# Altium schematic sheet HighCurrentSwitches.SchDoc
size A
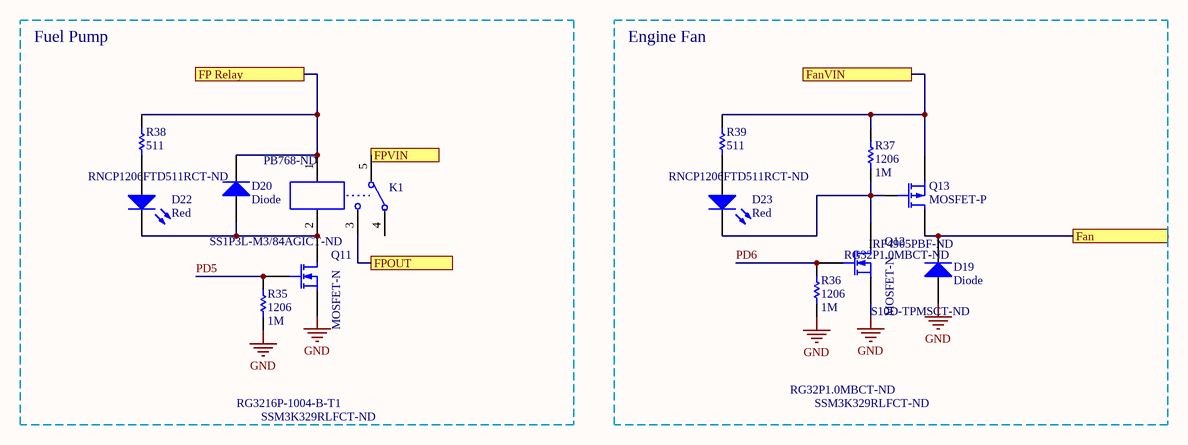
[diagram p0: HighCurrentSwitches.SchDoc]

## Parts
D19  Diode  Supplier Part Number: S10D-TPMSCT-ND  [SMC]
D20  Diode  Supplier Part Number: SS1P3L-M3/84AGICT-ND  [DO-220AA]
D22  Red  [LEDC3216X120NRED]
D23  Red  [LEDC3216X120NRED]
K1  Supplier Part Number: PB768-ND  [TECO-PB134-5_V]  (hidden comment: PB134012)
Q11  MOSFET-N  Supplier Part Number: SSM3K329RLFCT-ND  [SOT23-3]
Q12  MOSFET-N  Supplier Part Number: SSM3K329RLFCT-ND  [SOT23-3]
Q13  MOSFET-P  Supplier Part Number: IRF4905PBF-ND  [TO-220AB]
R35  1206  value 1M  Supplier Part Number: RG3216P-1004-B-T1  [RESC3216X60N]
R36  1206  value 1M  Supplier Part Number: RG32P1.0MBCT-ND  [RESC3216X60N]
R37  1206  value 1M  Supplier Part Number: RG32P1.0MBCT-ND  [RESC3216X60N]
R38  511  Supplier Part Number: RNCP1206FTD511RCT-ND  [RESC3216X60N]
R39  511  Supplier Part Number: RNCP1206FTD511RCT-ND  [RESC3216X60N]

## Blocks framed on the sheet
Fuel Pump: D20 D22 K1 Q11 R35 R38
Engine Fan: D19 D23 Q12 Q13 R36 R37 R39

## Ports
Fan, FanVIN, FP Relay, FPOUT, FPVIN

## Nets
GND: D19.1(A) Q11.3(S) Q12.3(S) R35.1 R36.1
Fan: D19.2(K) Q13.2(D) ; port Fan
FanVIN: Q13.3(S) R37.2 R39.1 ; port FanVIN
FP Relay: D20.2(K) K1.1(A1) R38.1 ; port FP Relay
FPOUT: K1.3 ; port FPOUT
FPVIN: K1.5 ; port FPVIN
PD5: Q11.2(G) R35.2
PD6: Q12.2(G) R36.2
NetD20_1: D20.1(A) D22.2(K) K1.2(A2) Q11.1(D)
NetD22_1: D22.1(A) R38.2
NetD23_1: D23.1(A) R39.2
NetD23_2: D23.2(K) Q12.1(D) Q13.1(G) R37.1

Not connected (* = marked no-connect by the designer): K1 4(12)

## Library data of the parts
D19 = Diode: Default Diode; Published: 8-Jun-2000; LatestRevisionDate: 17-Jul-2002; LatestRevisionNote: Re-released for DXP Platform.; PackageVersion: Sep-1996; PackageReference: SMC; Publisher: Altium Limited; PackageDescription: DO-214-AB/SMC; 2 C-Bend Leads; Body 7.9 x 5.9 mm, inc. leads (LxW); Code_JEDEC: DO-214-AB; Supplier 1: Digi-Key
D20 = Diode: Switching diode; Published: 8-Jun-2000; LatestRevisionDate: 17-Jul-2002; LatestRevisionNote: Re-released for DXP Platform.; PackageVersion: Sep-1996; PackageReference: SMC; Publisher: Altium Limited; PackageDescription: DO-214-AB/SMC; 2 C-Bend Leads; Body 7.9 x 5.9 mm, inc. leads (LxW); Code_JEDEC: DO-214-AB; Supplier 1: Digi-Key
D22 D23 = LED2_2: Typical RED, GREEN, YELLOW, AMBER GaAs LED; Manufacturer: Broadcom Avago; Manufacturer Part Number: HSMY-C150; Lens Colour: White,Clear; Viewing Angle: 170°; Lens Style: Diffused,Colorless,Rectangular; Wavelength: 586nm; Luminous Intensity: 8mcd; Forward Current: 20mA; Forward Voltage: 2.1V; Number of LEDs: 1; Reverse Voltage: 5V; Power Dissipation: 65mW; Lens Transparency: Diffused; Published: 8-Jun-2000; LatestRevisionDate: 17-Jul-2002; LatestRevisionNote: Re-released for DXP Platform.; PackageVersion: Feb-2002; PackageReference: 3.2X1.6X1.1; Publisher: Altium Limited; PackageDescription: SM LED; 2 Flat Leads; Supplier 1: Digi-Key; Stock 1: 0; Mount: Surface Mount; Case/Package: 1206; Number of Pins: 2; Colour: Yellow; Case Code (Metric): 3216; Case Code (Imperial): 1206; Contact Plating: Gold; Min Operating Temperature: -40°C; Max Operating Temperature: 85°C; Packaging: Tape and Reel; Package Quantity: 1; Illumination Colour: Yellow; Dominant Wavelength: 586nm; Test Current: 20mA; Number of Elements: 1; Power Rating: 65mW; Max Power Dissipation: 65mW; Voltage Rating (DC): 2.1V; Length: 3.2mm; Height: 1.1mm; Width: 1.6mm; Depth: 1.6mm; Radiation Hardening: No; REACH SVHC: No SVHC; Lead Free: Lead Free; ComponentLink1URL: https://datasheet.ciiva.com/15117/getdatasheetpartid-110528-15117488.pdf; ComponentLink1Description: https://datasheet.ciiva.com/15117/getdatasheetpartid-110528-15117488.pdf; ComponentLink2URL: https://datasheet.ciiva.com/11774/0900766b804a6539-11774578.pdf; ComponentLink2Description: https://datasheet.ciiva.com/11774/0900766b804a6539-11774578.pdf; ComponentLink3URL: https://datasheet.ciiva.com/19466/1557071-19466435.pdf; ComponentLink3Description: https://datasheet.ciiva.com/19466/1557071-19466435.pdf; ComponentLink4URL: https://datasheet.ciiva.com/14172/swseriehsmx-c150toc190-e-14172159.pdf; ComponentLink4Description: https://datasheet.ciiva.com/14172/swseriehsmx-c150toc190-e-14172159.pdf; ComponentLink5URL: https://datasheet.ciiva.com/29280/180507-da-01-en-chip-led-hsmy-c150-gelb-29280997.pdf; ComponentLink5Description: https://datasheet.ciiva.com/29280/180507-da-01-en-chip-led-hsmy-c150-gelb-29280997.pdf; Supplier 2: Digi-Key; Stock 2: 0; ComponentLink6URL: https://datasheet.ciiva.com/11773/0900766b804a6539-11773956.pdf; ComponentLink6Description: https://datasheet.ciiva.com/11773/0900766b804a6539-11773956.pdf; ComponentLink7URL: https://datasheet.ciiva.com/15117/getdatasheetpartid-142358-15117749.pdf; ComponentLink7Description: https://datasheet.ciiva.com/15117/getdatasheetpartid-142358-15117749.pdf; ComponentLink8URL: https://datasheet.ciiva.com/46426/313031-46426533.pdf; ComponentLink8Description: https://datasheet.ciiva.com/46426/313031-46426533.pdf; ComponentLink9URL: https://datasheet.ciiva.com/14172/swseriehsmx-c150toc190-e-14172156.pdf; ComponentLink9Description: https://datasheet.ciiva.com/14172/swseriehsmx-c150toc190-e-14172156.pdf; ComponentLink10URL: https://datasheet.ciiva.com/29281/180509-da-01-en-chip-led-hsmh-c150-rot-29281009.pdf; ComponentLink10Description: https://datasheet.ciiva.com/29281/180509-da-01-en-chip-led-hsmh-c150-rot-29281009.pdf; Supplier 3: Digi-Key; Supplier 4: Digi-Key; Supplier Part Number: 732-4992-1-ND
K1 = PB134012: Miniature Power PCB Relay PB, 1 Form A Contact, 12 V, 10 A, 360 mW, Standard Version, -40 to 85 degC, 5-Pin 15 x 15 x 20 mm THD, RoHS, Tube; Contact Form: 1 Form A (SPST-NO); Contact Current Rating: 10 A; Coil Resistance: 400 Ohms; Coil Voltage: 24 V; DatasheetVersion: Rev. 0411; PackageReference: THD; Supplier 1: Newark; Supplier Part Number 1: 15AC8464; Supplier 2: Farnell; Supplier Part Number 2: 2748039; Supplier 3: Digi-Key; Contact Material: Silver Nickel; Mounting Style: Through Hole; Mounting Technology: Through Hole; ComponentLink1Description: Manufacturer URL; ComponentLink1URL: http://www.te.com; ComponentLink2Description: Datasheet; ComponentLink2URL: http://www.te.com/commerce/DocumentDelivery/DDEController?Action=showdoc&DocId=Data+Sheet%7FPB%7F0411%7Fpdf%7FEnglish%7FENG_DS_PB_0411.pdf%7F2-1415030-1
Q11 Q12 = MOSFET-N: N-Channel MOSFET; Published: 8-Jun-2000; LatestRevisionDate: 17-Jul-2002; LatestRevisionNote: Re-released for DXP Platform.; PackageVersion: 1995/1996; PackageReference: E3; Publisher: Altium Limited; PackageDescription: TO, Flat Index; 3 In-Line, Axial Leads; Body Dia. 4.6mm; Lead Dia. 0.5 mm (max); Supplier 1: Digi-Key
Q13 = MOSFET-P: P-Channel MOSFET; Published: 8-Jun-2000; LatestRevisionDate: 17-Jul-2002; LatestRevisionNote: Re-released for DXP Platform.; PackageVersion: 1995/1996; PackageReference: E3; Publisher: Altium Limited; PackageDescription: TO, Flat Index; 3 In-Line, Axial Leads; Body Dia. 4.6mm; Lead Dia. 0.5 mm (max); Supplier 1: Digi-Key
R35-R39 = Res1: Resistor; Published: 8-Jun-2000; LatestRevisionDate: 17-Jul-2002; LatestRevisionNote: Re-released for DXP Platform.; PackageReference: AXIAL-0.3; Publisher: Altium Limited; PackageDescription: Axial Device, Thru-Hole; 2 Leads; 0.3 in Pin Spacing; Supplier 1: Digi-Key
  R38 R39: Value: 511